# Altium schematic sheet PAGE1-CONTENT.SchDoc
size A3; DocumentNumber: 1; SheetNumber: 1; SheetTotal: 5
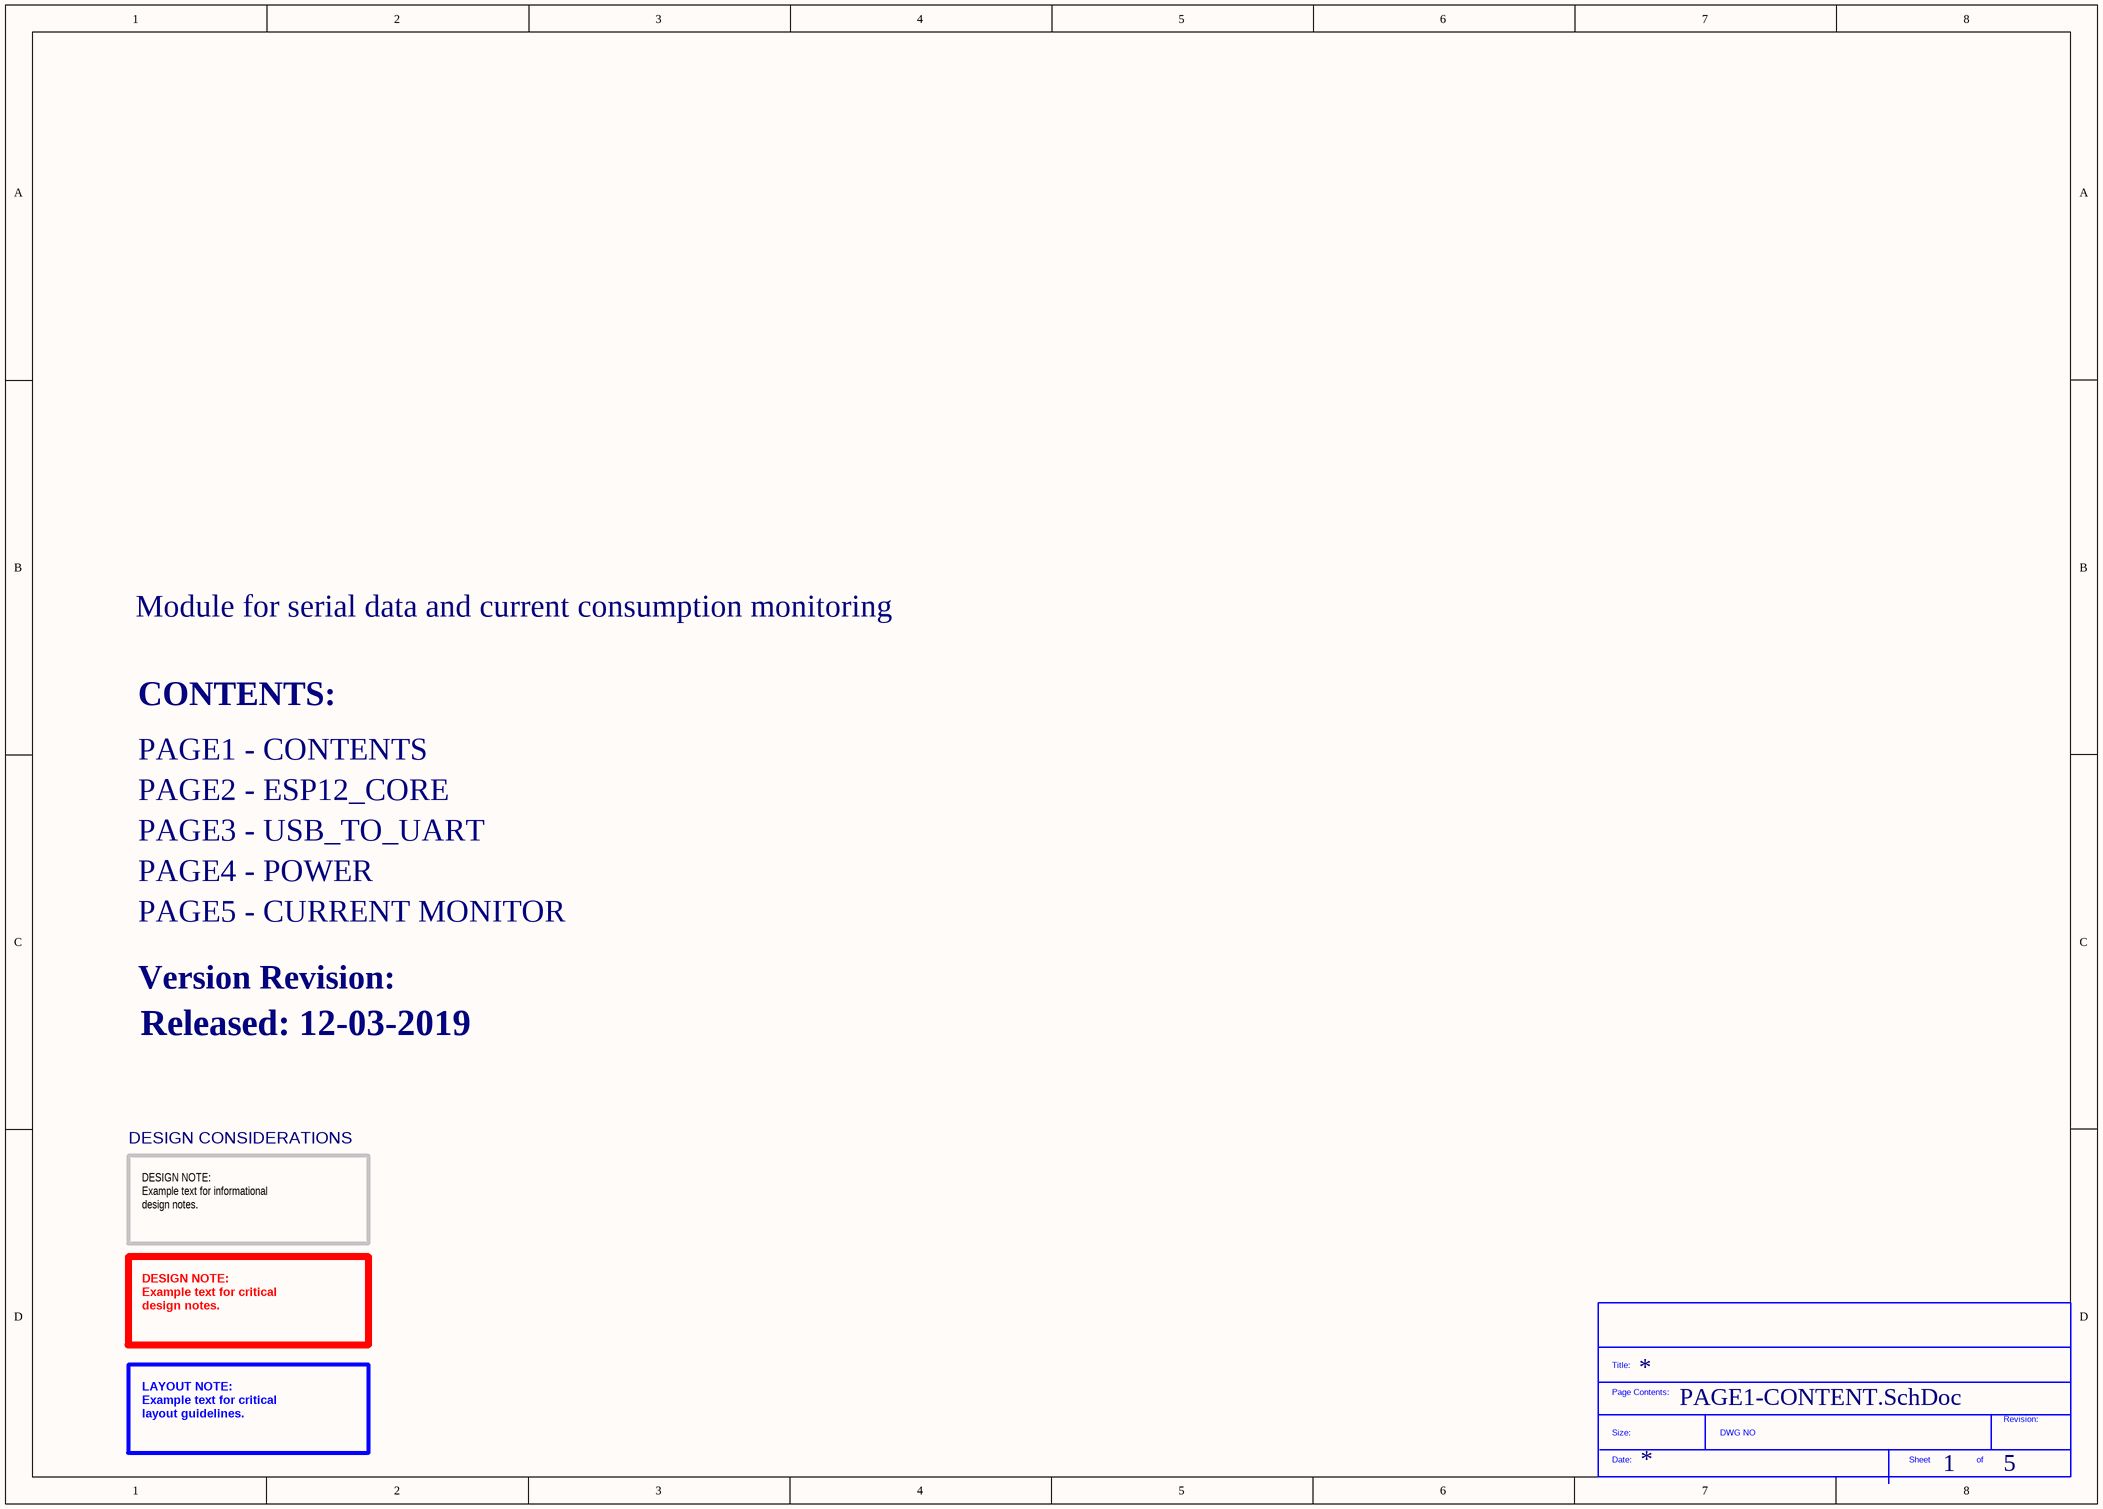
[diagram p0: PAGE1-CONTENT.SchDoc]

## Parts
*?  SDTitleBlock  (value not drawn)  (graphical)

## Notes on the sheet
- Module for serial data and current consumption monitoring
- CONTENTS:
- PAGE1 - CONTENTS
- PAGE2 - ESP12_CORE
- PAGE3 - USB_TO_UART
- PAGE4 - POWER
- Version Revision:
- PAGE5 - CURRENT MONITOR
- Released: 12-03-2019
- DESIGN CONSIDERATIONS
- DESIGN NOTE:
  Example text for informational
  design notes.
- DESIGN NOTE:
  Example text for critical
  design notes.
- LAYOUT NOTE:
  Example text for critical
  layout guidelines.
- Title
- Size:
- Date:
- A3
- Number:
- Time:
- Revision:
- Sheet
- of
- File:
- (in symbol SDTitleBlock) Title:; Page Contents:; Revision:; Size:; DWG NO; Date:; Sheet; of